# Altium schematic sheet STM32.SchDoc
size A3; SheetNumber: 1; SheetTotal: 4
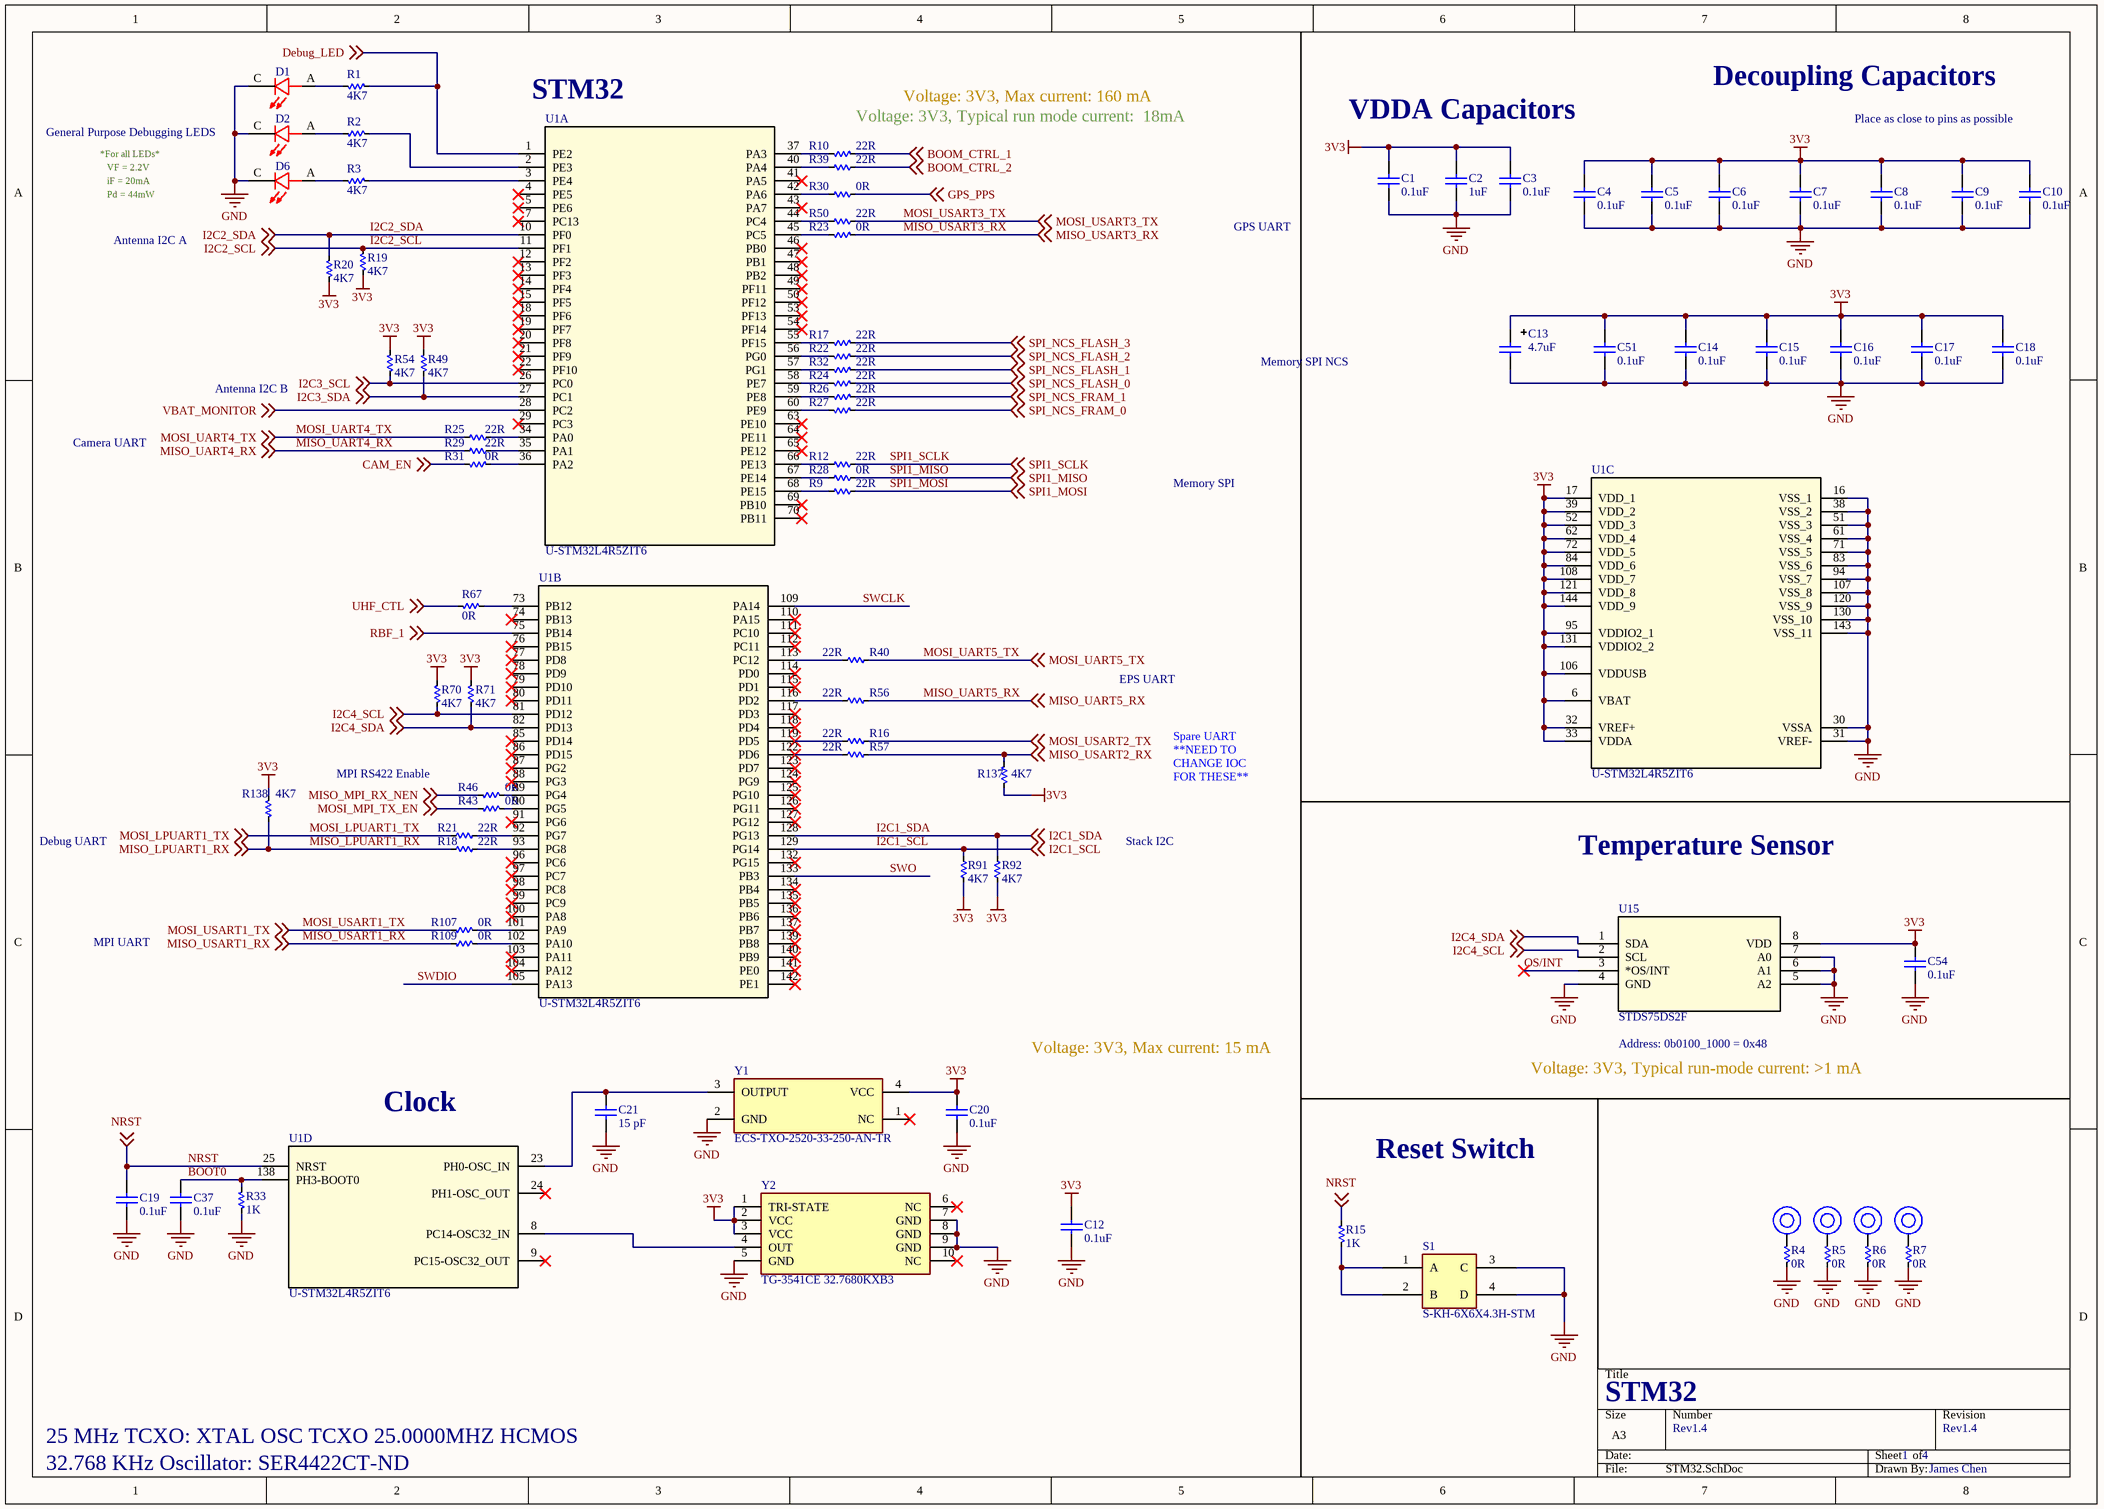
[diagram p0: STM32.SchDoc]

## Parts
*1  PC104 Mounting  [PC104 Mounting Points]  (value not drawn)  (no BOM)
*2  PC104 Mounting  [PC104 Mounting Points]  (value not drawn)  (no BOM)
*3  PC104 Mounting  [PC104 Mounting Points]  (value not drawn)  (no BOM)
*4  PC104 Mounting  [PC104 Mounting Points]  (value not drawn)  (no BOM)
C1  0.1uF  [0603]
C2  1uF  [0603]
C3  0.1uF  [0603]
C4  0.1uF  [0603]
C5  0.1uF  [0603]
C6  0.1uF  [0603]
C7  0.1uF  [0603]
C8  0.1uF  [0603]
C9  0.1uF  [0603]
C10  0.1uF  [0603]
C12  0.1uF  [0603]
C13  4.7uF  [CAP TANT 1206 (A) TCJ]
C14  0.1uF  [0603]
C15  0.1uF  [0603]
C16  0.1uF  [0603]
C17  0.1uF  [0603]
C18  0.1uF  [0603]
C19  0.1uF  [0603]
C20  0.1uF  [0603]
C21  15 pF  [0402]
C37  0.1uF  [0402]
C51  0.1uF  [0603]
C54  0.1uF  [0603]
D1  D-SML-D12U1WT86  [D-SML-D12U1WT86]  (value not drawn)
D2  D-SML-D12U1WT86  [D-SML-D12U1WT86]  (value not drawn)
D6  D-SML-D12U1WT86  [D-SML-D12U1WT86]  (value not drawn)
R1  4K7  [0603]
R2  4K7  [0603]
R3  4K7  [0603]
R4  value 0R  [0603]  (hidden comment: 0R DNP)
R5  value 0R  [0603]  (hidden comment: 0R DNP)
R6  value 0R  [0603]  (hidden comment: 0R DNP)
R7  value 0R  [0603]  (hidden comment: 0R DNP)
R9  22R  [0603]
R10  22R  [0603]
R12  22R  [0603]
R15  1K  [0603]
R16  22R  [0603]
R17  22R  [0603]
R18  22R  [0603]
R19  4K7  [0603]
R20  4K7  [0603]
R21  22R  [0603]
R22  22R  [0603]
R23  0R  [0603]
R24  22R  [0603]
R25  22R  [0603]
R26  22R  [0603]
R27  22R  [0603]
R28  0R  [0603]
R29  22R  [0603]
R30  0R  [0603]
R31  0R  [0603]
R32  22R  [0603]
R33  1K  [0603]
R39  22R  [0603]
R40  22R  [0603]
R43  0R  [0603]
R46  0R  [0603]
R49  4K7  [0603]
R50  22R  [0603]
R54  4K7  [0603]
R56  22R  [0603]
R57  22R  [0603]
R67  0R  [0603]
R70  4K7  [0603]
R71  4K7  [0603]
R91  4K7  [0603]
R92  4K7  [0603]
R107  0R  [0603]
R109  0R  [0603]
R137  4K7  [0603]
R138  4K7  [0603]
S1  S-KH-6X6X4.3H-STM  [S-KH-6X6X4.3H-STM]
U1  U-STM32L4R5ZIT6  [U-STM32L4R5ZIT6]  (parts A,B,C,D of 4)
U15  STDS75DS2F  [MSOP-8_STM-M]
Y1  ECS-TXO-2520-33-250-AN-TR  [Y-ECS-TXO-2520-33-250-AN-TR]
Y2  TG-3541CE 32.7680KXB3  [Y-TG-3541CE 32.7680KXB3]

## Nets
3V3: C1.2 C2.2 C3.2 C4.2 C5.2 C6.2 C7.2 C8.2 C9.2 C10.2 C12.2 C13.1 C14.2 C15.2 C16.2 C17.2 C18.2 C20.2 C51.2 C54.2 R19.1 R20.1 R49.1 R54.1 R70.1 R71.1 R91.2 R92.1 R137.2 R138.1 U1.6(VBAT) U1.17(VDD_1) U1.32(VREF+) U1.33(VDDA) U1.39(VDD_2) U1.52(VDD_3) U1.62(VDD_4) U1.72(VDD_5) U1.84(VDD_6) U1.95(VDDIO2_1) U1.106(VDDUSB) U1.108(VDD_7) U1.121(VDD_8) U1.131(VDDIO2_2) U1.144(VDD_9) U15.8(VDD) Y1.4(VCC) Y2.1(TRI-STATE) Y2.2(VCC) Y2.3(VCC)
GND: C1.1 C2.1 C3.1 C4.1 C5.1 C6.1 C7.1 C8.1 C9.1 C10.1 C12.1 C13.2 C14.1 C15.1 C16.1 C17.1 C18.1 C19.1 C20.1 C21.2 C37.2 C51.1 C54.1 D1.C D2.C D6.C R4.1 R5.1 R6.1 R7.1 R33.1 S1.3(C) S1.4(D) U1.16(VSS_1) U1.30(VSSA) U1.31(VREF-) U1.38(VSS_2) U1.51(VSS_3) U1.61(VSS_4) U1.71(VSS_5) U1.83(VSS_6) U1.94(VSS_7) U1.107(VSS_8) U1.120(VSS_9) U1.130(VSS_10) U1.143(VSS_11) U15.4(GND) U15.5(A2) U15.6(A1) U15.7(A0) Y1.2(GND) Y2.5(GND) Y2.7(GND) Y2.8(GND) Y2.9(GND)
BOOM_CTRL_1: R10.2 ; off-sheet BOOM_CTRL_1
BOOM_CTRL_2: R39.1 ; off-sheet BOOM_CTRL_2
BOOT0: C37.1 R33.2 U1.138(PH3-BOOT0)
CAM_EN: R31.1 ; off-sheet CAM_EN
Debug_LED: R1.2 U1.1(PE2) ; off-sheet Debug_LED
GPS_PPS: R30.2 ; off-sheet GPS_PPS
I2C1_SCL: R91.1 U1.129(PG14) ; off-sheet I2C1_SCL
I2C1_SDA: R92.2 U1.128(PG13) ; off-sheet I2C1_SDA
I2C2_SCL: R19.2 U1.11(PF1) ; off-sheet I2C2_SCL
I2C2_SDA: R20.2 U1.10(PF0) ; off-sheet I2C2_SDA
I2C3_SCL: R54.2 U1.26(PC0) ; off-sheet I2C3_SCL
I2C3_SDA: R49.2 U1.27(PC1) ; off-sheet I2C3_SDA
I2C4_SCL: R70.2 U1.81(PD12) U15.2(SCL) ; off-sheet I2C4_SCL
I2C4_SDA: R71.2 U1.82(PD13) U15.1(SDA) ; off-sheet I2C4_SDA
MISO_LPUART1_RX: R18.1 R138.2 ; off-sheet MISO_LPUART1_RX
MISO_MPI_RX_NEN: R46.2 ; off-sheet MISO_MPI_RX_NEN
MISO_UART4_RX: R29.1 ; off-sheet MISO_UART4_RX
MISO_UART5_RX: R56.2 ; off-sheet MISO_UART5_RX
MISO_USART1_RX: R109.1 ; off-sheet MISO_USART1_RX
MISO_USART2_RX: R57.2 R137.1 ; off-sheet MISO_USART2_RX
MISO_USART3_RX: R23.2 ; off-sheet MISO_USART3_RX
MOSI_LPUART1_TX: R21.1 ; off-sheet MOSI_LPUART1_TX
MOSI_MPI_TX_EN: R43.2 ; off-sheet MOSI_MPI_TX_EN
MOSI_UART4_TX: R25.1 ; off-sheet MOSI_UART4_TX
MOSI_UART5_TX: R40.2 ; off-sheet MOSI_UART5_TX
MOSI_USART1_TX: R107.1 ; off-sheet MOSI_USART1_TX
MOSI_USART2_TX: R16.2 ; off-sheet MOSI_USART2_TX
MOSI_USART3_TX: R50.1 ; off-sheet MOSI_USART3_TX
NRST: C19.2 R15.2 U1.25(NRST) ; off-sheet NRST
OS/INT: U15.3(*OS/INT)
RBF_1: U1.75(PB14) ; off-sheet RBF_1
SPI1_MISO: R28.2 ; off-sheet SPI1_MISO
SPI1_MOSI: R9.1 ; off-sheet SPI1_MOSI
SPI1_SCLK: R12.1 ; off-sheet SPI1_SCLK
SPI_NCS_FLASH_0: R24.2 ; off-sheet SPI_NCS_FLASH_0
SPI_NCS_FLASH_1: R32.2 ; off-sheet SPI_NCS_FLASH_1
SPI_NCS_FLASH_2: R22.2 ; off-sheet SPI_NCS_FLASH_2
SPI_NCS_FLASH_3: R17.2 ; off-sheet SPI_NCS_FLASH_3
SPI_NCS_FRAM_0: R27.2 ; off-sheet SPI_NCS_FRAM_0
SPI_NCS_FRAM_1: R26.2 ; off-sheet SPI_NCS_FRAM_1
SWCLK: U1.109(PA14)
SWDIO: U1.105(PA13)
SWO: U1.133(PB3)
UHF_CTL: R67.1 ; off-sheet UHF_CTL
VBAT_MONITOR: U1.28(PC2) ; off-sheet VBAT_MONITOR
Net*1_1: *1.1 R4.2
Net*2_1: *2.1 R5.2
Net*3_1: *3.1 R6.2
Net*4_1: *4.1 R7.2
NetC21_1: C21.1 U1.23(PH0-OSC_IN) Y1.3(OUTPUT)
NetD1_A: D1.A R1.1
NetD2_A: D2.A R2.1
NetD6_A: D6.A R3.2
NetR2_2: R2.2 U1.2(PE3)
NetR3_1: R3.1 U1.3(PE4)
NetR9_2: R9.2 U1.68(PE15)
NetR10_1: R10.1 U1.37(PA3)
NetR12_2: R12.2 U1.66(PE13)
NetR15_1: R15.1 S1.1(A) S1.2(B)
NetR16_1: R16.1 U1.119(PD5)
NetR17_1: R17.1 U1.55(PF15)
NetR18_2: R18.2 U1.93(PG8)
NetR21_2: R21.2 U1.92(PG7)
NetR22_1: R22.1 U1.56(PG0)
NetR23_1: R23.1 U1.45(PC5)
NetR24_1: R24.1 U1.58(PE7)
NetR25_2: R25.2 U1.34(PA0)
NetR26_1: R26.1 U1.59(PE8)
NetR27_1: R27.1 U1.60(PE9)
NetR28_1: R28.1 U1.67(PE14)
NetR29_2: R29.2 U1.35(PA1)
NetR30_1: R30.1 U1.42(PA6)
NetR31_2: R31.2 U1.36(PA2)
NetR32_1: R32.1 U1.57(PG1)
NetR39_2: R39.2 U1.40(PA4)
NetR40_1: R40.1 U1.113(PC12)
NetR43_1: R43.1 U1.90(PG5)
NetR46_1: R46.1 U1.89(PG4)
NetR50_2: R50.2 U1.44(PC4)
NetR56_1: R56.1 U1.116(PD2)
NetR57_1: R57.1 U1.122(PD6)
NetR67_2: R67.2 U1.73(PB12)
NetR107_2: R107.2 U1.101(PA9)
NetR109_2: R109.2 U1.102(PA10)
NetU1_8: U1.8(PC14-OSC32_IN) Y2.4(OUT)

Not connected (* = marked no-connect by the designer): U1 4(PE5)* 5(PE6)* 7(PC13)* 9(PC15-OSC32_OUT)* 12(PF2)* 13(PF3)* 14(PF4)* 15(PF5)* 18(PF6)* 19(PF7)* 20(PF8)* 21(PF9)* 22(PF10)* 24(PH1-OSC_OUT)* 29(PC3)* 41(PA5)* 43(PA7)* 46(PB0)* 47(PB1)* 48(PB2)* 49(PF11)* 50(PF12)* 53(PF13)* 54(PF14)* 63(PE10)* 64(PE11)* 65(PE12)* 69(PB10)* 70(PB11)* 74(PB13)* 76(PB15)* 77(PD8)* 78(PD9)* 79(PD10)* 80(PD11)* 85(PD14)* 86(PD15)* 87(PG2)* 88(PG3)* 91(PG6)* 96(PC6)* 97(PC7)* 98(PC8)* 99(PC9)* 100(PA8)* 103(PA11)* 104(PA12)* 110(PA15)* 111(PC10)* 112(PC11)* 114(PD0)* 115(PD1)* 117(PD3)* 118(PD4)* 123(PD7)* 124(PG9)* 125(PG10)* 126(PG11)* 127(PG12)* 132(PG15)* 134(PB4)* 135(PB5)* 136(PB6)* 137(PB7)* 139(PB8)* 140(PB9)* 141(PE0)* 142(PE1)*; Y1 1(NC)*; Y2 6(NC)* 10(NC)*

## Notes on the sheet
- (near U1) STM32
- Voltage: 3V3, Max current: 160 mA
- Decoupling Capacitors
- General Purpose Debugging LEDS
- *For all LEDs*
- VF = 2.2V
- iF = 20mA
- Voltage: 3V3, Typical run mode current:  18mA
- VDDA Capacitors
- Place as close to pins as possible
- Pd = 44mW
- Antenna I2C A
- GPS UART
- Memory SPI NCS
- Camera UART
- Antenna I2C B
- Memory SPI
- EPS UART
- MPI RS422 Enable
- Spare UART **NEED TO CHANGE IOC FOR THESE**
- Debug UART
- Stack I2C
- Temperature Sensor
- MPI UART
- Voltage: 3V3, Max current: 15 mA
- Address: 0b0100_1000 = 0x48
- (near U1) Clock
- Voltage: 3V3, Typical run-mode current: >1 mA
- Reset Switch
- 25 MHz TCXO: XTAL OSC TCXO 25.0000MHZ HCMOS
- STM32
- Rev1.4
- 1
- 4
- 32.768 KHz Oscillator: SER4422CT-ND
- James Chen

## Library data of the parts
C1 C3-C10 C14-C19 C51 = CC-100nF-25V-X7R-0603: 25V 100nF X7R ±10% 0603 Multilayer Ceramic Capacitors MLCC - SMD/SMT ROHS; Manufacturer: Murata Electronics; Manufacturer Part #: GCJ188R71E104KA12D; Max Exposed Voltage: 6; Rated Voltage: 25; ComponentLink1description: Datasheet; ComponentLink1URL: https://ds.yuden.co.jp/TYCOMPAS/ut/detail?pn=TMK105BJ104KV-F%20%20&u=M; ComponentLink2description: Manufacturer Website; Distributor: LCSC; Distributor Part #: C354391; Part Description: 25V 100nF X7R ±10% 0603 Multilayer Ceramic Capacitors MLCC - SMD/SMT ROHS; ComponentLink2URL: https://www.yuden.co.jp/or/; Value: 0.1uF; Highest Rated Operating Temperature: 125; Lowest Rated Operating Temperature: -55
C2 = CC-105-K-25V-X7R-0603: CAP CER 1UF 25V X7R 0603; Manufacturer: Yageo; Manufacturer Part #: CC0603KRX7R8BB105; ComponentLink1Description: Datasheet; ComponentLink1URL: https://www.yageo.com/upload/media/product/productsearch/datasheet/mlcc/UPY-GPHC_X7R_6.3V-to-50V_18.pdf; ComponentLink2Description: Manufacture Website; ComponentLink2URL: https://www.yageo.com/en/Home; Distributor: Digikey; Distributor Part #: 311-1802-1-ND; Part Description: CAP CER 1UF 25V X7R 0603; SignalCraft Part #: CC-105-K-25V-X7R-0603; Value: 1uF
C12 C20 C54 = CC-100nF-25V-X7R-0603: 25V 100nF X7R ±10% 0603 Multilayer Ceramic Capacitors MLCC - SMD/SMT ROHS; Manufacturer: Murata Electronics; Manufacturer Part #: GCJ188R71E104KA12D; Rated Voltage: 25; Max Exposed Voltage: 6; ComponentLink1description: Datasheet; ComponentLink1URL: https://ds.yuden.co.jp/TYCOMPAS/ut/detail?pn=TMK105BJ104KV-F%20%20&u=M; ComponentLink2description: Manufacturer Website; Distributor: LCSC; Distributor Part #: C354391; Part Description: 25V 100nF X7R ±10% 0603 Multilayer Ceramic Capacitors MLCC - SMD/SMT ROHS; ComponentLink2URL: https://www.yuden.co.jp/or/; Value: 0.1uF; Lowest Rated Operating Temperature: -55; Highest Rated Operating Temperature: 125
C13 = CT-474-M-20V-OTH-1206: 4.7 µF Molded Tantalum Capacitors 20 V 1206 (3216 Metric) 4Ohm; Manufacturer: AVX Corporation; Manufacturer Part #: TAJA475K020RNJ; ComponentLink1Description: Datasheet; ComponentLink1URL: *; ComponentLink2Description: Manufacturer Website; ComponentLink2URL: *; Distributor: Digikey; Distributor Part #: 478-1668-1-ND; Part Description: 4.7 µF Molded Tantalum Capacitors 20 V 1206 (3216 Metric) 4Ohm; Value: 4.7uF
C21 = CC-159-J-50V-C0G-0402: 15 pF ±1% 50V Ceramic Capacitor C0G, NP0 0402 (1005 Metric); Manufacturer: YAGEO; Manufacturer Part #: CC0402FRNPO9BN150; ComponentLink1Description: Datasheet; ComponentLink1URL: *; ComponentLink2Description: Manufacture Website; ComponentLink2URL: *; Distributor: Digikey; Distributor Part #: 311-1642-1-ND; Part Description: 15 pF ±1% 50V Ceramic Capacitor C0G, NP0 0402 (1005 Metric); Value: 15 pF
C37 = CC-104-K-25V-X7R-0402: CAP CER 0.1UF 25V X7R 0402; Manufacturer: YAGEO; Manufacturer Part #: CC0402KPX7R8BB104; ComponentLink1description: Datasheet; ComponentLink1URL: https://ds.yuden.co.jp/TYCOMPAS/ut/detail?pn=TMK105BJ104KV-F%20%20&u=M; ComponentLink2description: Manufacturer Website; Distributor: Digikey; Distributor Part #: 13-CC0402KPX7R8BB104CT-ND; Part Description: CAP CER 0.1UF 25V X7R 0402; ComponentLink2URL: https://www.yuden.co.jp/or/; Value: 0.1uF
D1 D2 D6 = D-SML-D12U1WT86: Red 620nm LED Indication - Discrete 2.2V 0603 _1608 Metric; Manufacturer: Rohm Semiconductor; Manufacturer Part #: SML-D12U1WT86; Distributor: Digikey; Distributor Part #: SML-D12U1WT86CT-ND
R1-R3 R19 R20 R49 R54 R70 R71 R91 R92 R137 R138 = RT-4K7-F-1/16W-0603: RES SMD 4.7K OHM 1% 1/10W 0603; Manufacturer: Bourns Inc.; Manufacturer Part #: CR0603-FX-4701ELF; ComponentLink1description: Datasheet; ComponentLink1URL: https://www.vishay.com/docs/20035/dcrcwe3.pdf; ComponentLink2description: Manufacturer Website; Distributor: Digikey; Distributor Part #: CR0603-FX-4701ELFCT-ND; Part Description: RES SMD 4.7K OHM 1% 1/10W 0603; ComponentLink2URL: https://www.vishay.com/; Value: 4K7
R4-R7 R23 R28 R30 R31 R43 R46 R67 R107 R109 = RT-0R00-F-1/10W-0603: 0 Ohms Jumper 0.1W, 1/10W Chip Resistor 0603 (1608 Metric) Automotive AEC-Q200 Thick Film; Manufacturer: Stackpole Electronics Inc; Manufacturer Part #: RMCF0603ZT0R00; ComponentLink1description: Datasheet; ComponentLink1URL: https://industrial.panasonic.com/ww/products/resistors/chip-resistors/general-purpose-chip-resistors/models/ERJ2GE0R00X; ComponentLink2description: Manufacturer Website; Distributor: Digikey; Distributor Part #: RMCF0603ZT0R00CT-ND; Part Description: 0 Ohms Jumper 0.1W, 1/10W Chip Resistor 0603 (1608 Metric) Automotive AEC-Q200 Thick Film; ComponentLink2URL: https://industrial.panasonic.com/ww/products/resistors/chip-resistors/general-purpose-chip-resistors/models/ERJ2GE0R00X
  R23 R28 R30 R31 R43 R46 R67 R107 R109: Value: 0R
R9 R10 R12 R16-R18 R21 R22 R24-R27 R29 R32 R39 R40 R50 R56 R57 = RT-22R0-F-1/16W-0603: 22 Ohms ±0.5% 0.063W, 1/16W Chip Resistor 0603 (1608 Metric) - Thin Film; Manufacturer: Susumu; Manufacturer Part #: RR0816Q-220-D; ComponentLink1description: Datasheet; ComponentLink1URL: https://www.vishay.com/docs/20035/dcrcwe3.pdf; ComponentLink2description: Manufacturer Website; Distributor: Digikey; Distributor Part #: RR08Q22DCT-ND; Part Description: 22 Ohms ±0.5% 0.063W, 1/16W Chip Resistor 0603 (1608 Metric) - Thin Film; ComponentLink2URL: https://www.vishay.com/; Value: 22R
R15 R33 = RT-1K0-F-1/16W-0603: RES SMD 1K OHM 1% 1/16W 0603; Manufacturer: TE Connectivity Passive Product; Manufacturer Part #: CPF0603F1K0C1; ComponentLink1description: Datasheet; ComponentLink1URL: https://www.vishay.com/docs/20035/dcrcwe3.pdf; ComponentLink2description: Manufacturer Website; Distributor: Digikey; Distributor Part #: A102226CT-ND; Part Description: RES SMD 1K OHM 1% 1/16W 0603; ComponentLink2URL: https://www.vishay.com/; Value: 1K
S1 = S-KH-6X6X4.3H-STM: NO 50mA Brick nogging SPST 80000次 12V SMD Tactile Switches ROHS; Manufacturer: Shenzhen Kinghelm Elec; Manufacturer Part #: KH-6X6X4.3H-STM; Distributor: LCSC; Distributor Part #: C2837530; LCSC Part #: C2837530
U1 = U-STM32L4R5ZIT6: IC MCU 32BIT 2MB FLASH 144LQFP; Manufacturer: STMicroelectronics; Distributor: Mouser; Manufacturer Part #: STM32L4R5ZIT6; Mouser Part Number: 511-STM32L4R5ZIT6P; LCSC Part #: C1339786
U15 = U-STDS75DS2F: MSOP-8 Temperature Sensors ROHS; Manufacturer: STMicroelectronics; Distributor: LCSC; Distributor Part #: C283289; Manufacturer Part #: STDS75DS2F; LCSC Part #: C283289
Y1 = Y-ECS-TXO-2520-33-250-AN-TR: XTAL OSC TCXO 25.0000MHZ HCMOS; Manufacturer: ECS Inc.; Manufacturer Part #: ECS-TXO-2520-33-250-AN-TR; Distributor: Digikey; Distributor Part #: XC2258CT-ND
Y2 = Y-TG-3541CE 32.7680KXB3: XTAL OSC TCXO 32.7680KHZ CMOS; Manufacturer: EPSON; Manufacturer Part #: TG-3541CE 32.7680KXB3; Distributor: Digikey; Distributor Part #: SER4422CT-ND